# EAGLE design 3310 (EAGLE 9.1.3)
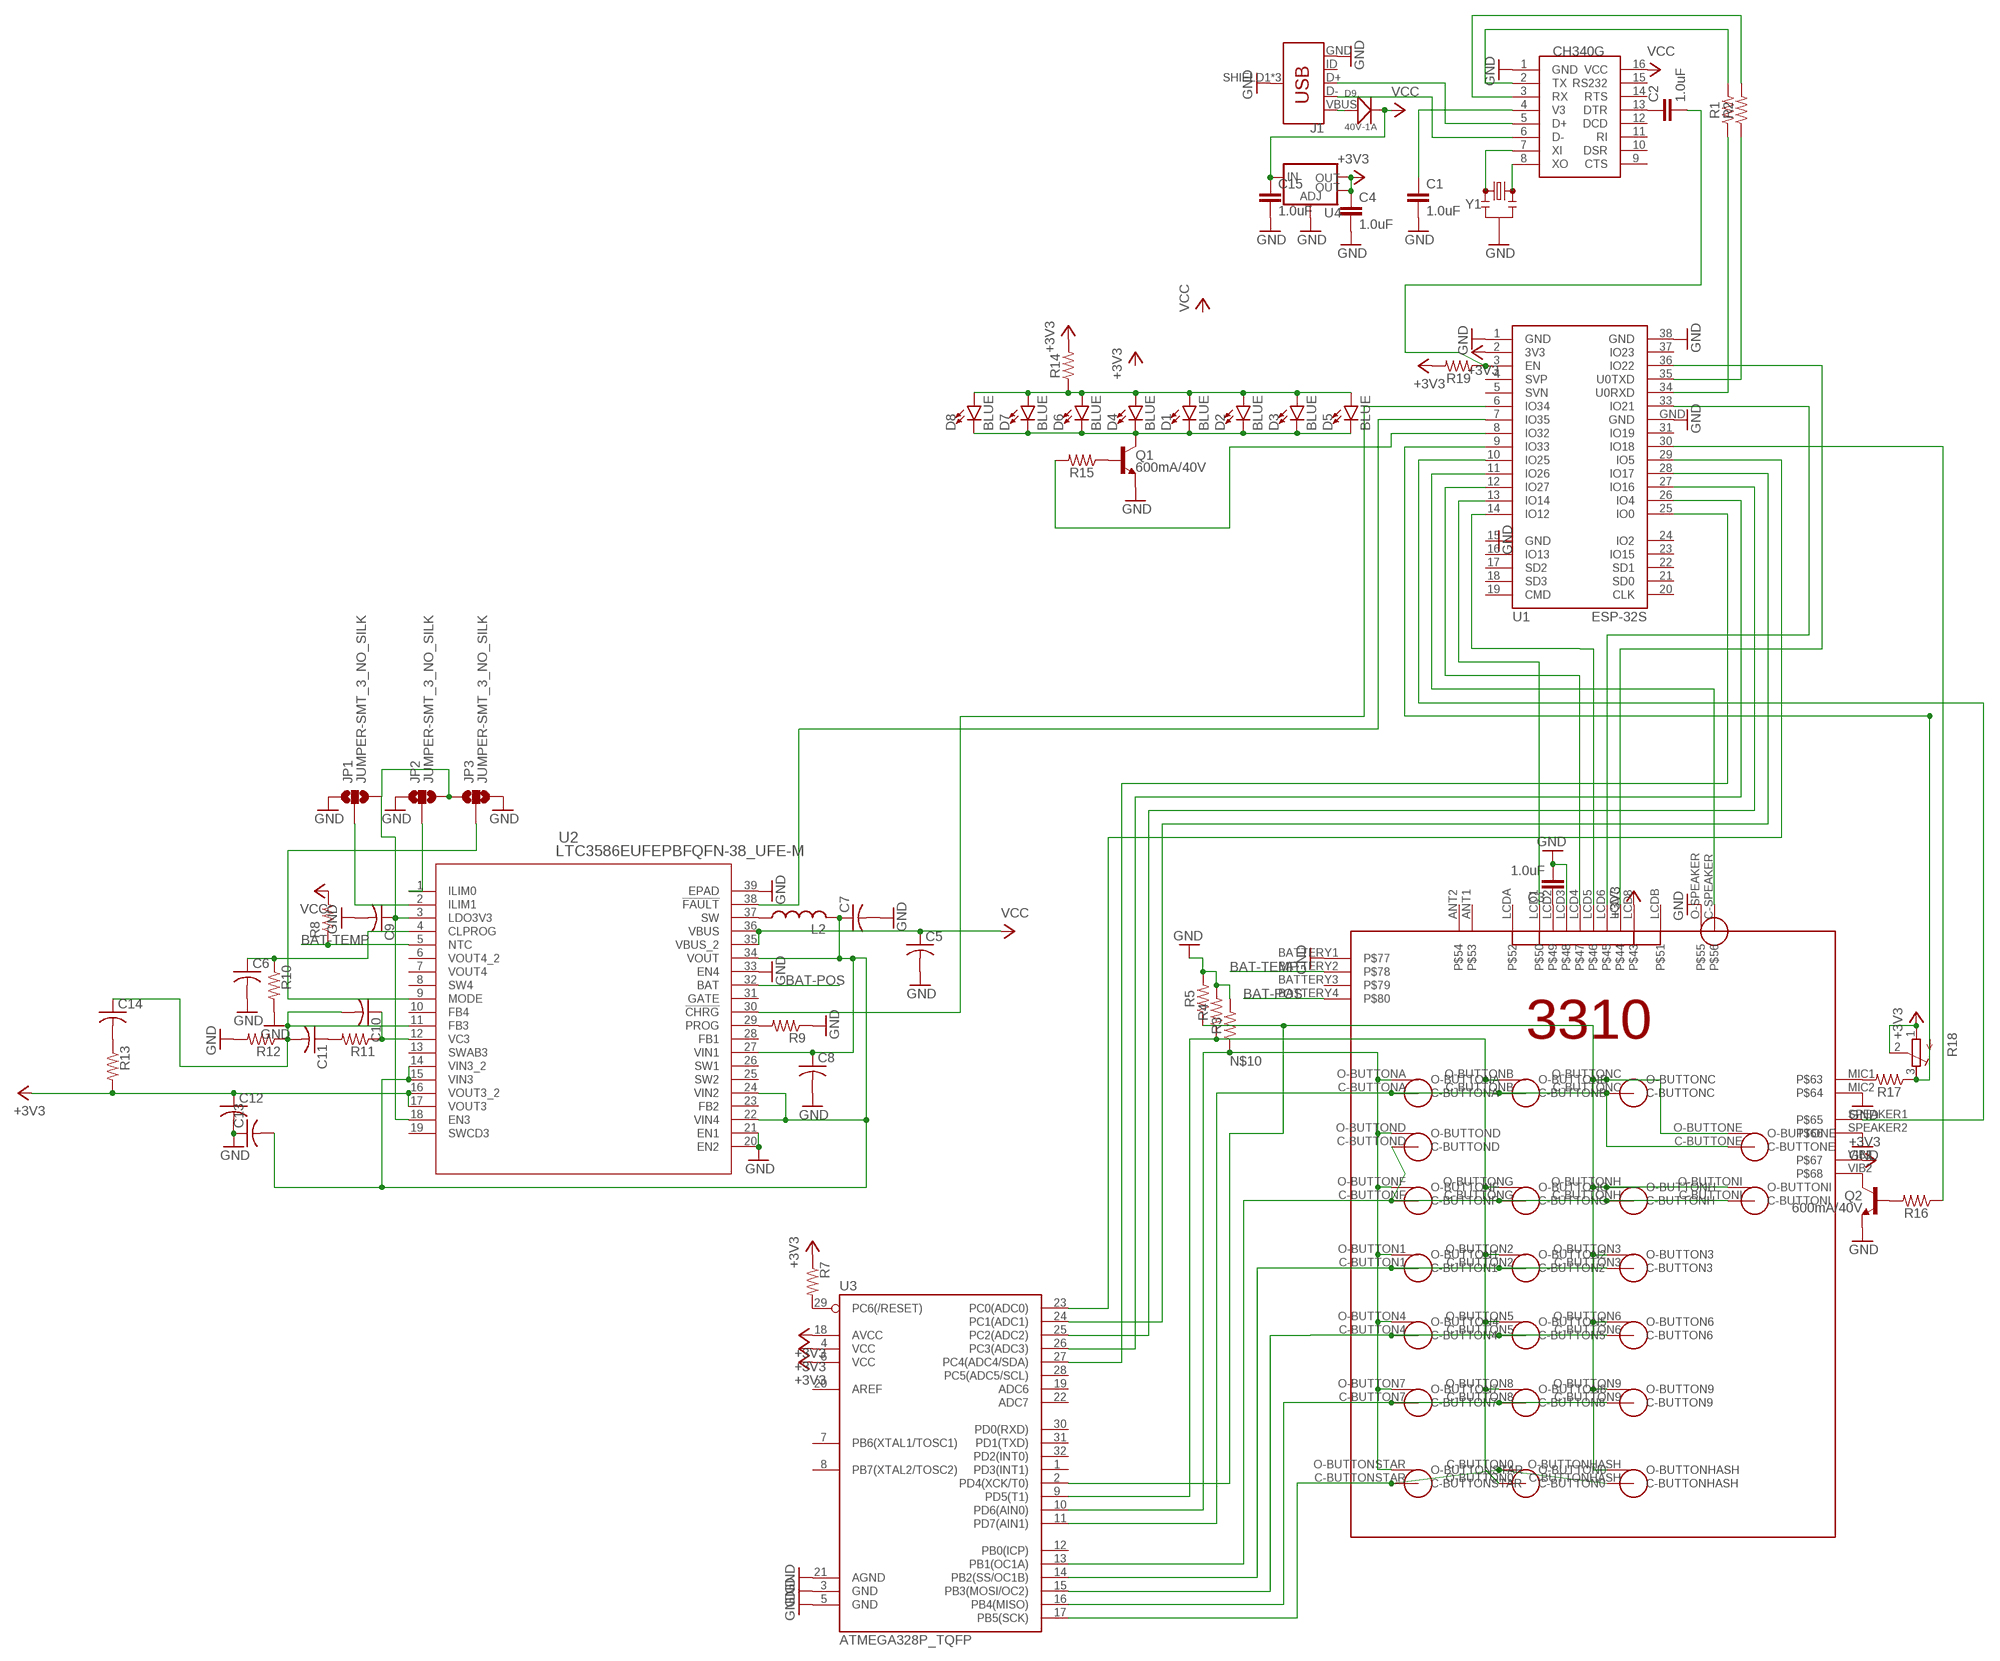
[diagram p0: schematic, sheet 1]

## Parts
C1  1.0uF  1.0UF-0805-25V-10%  [0805]
C2  1.0uF  1.0UF-0805-25V-10%  [0805]
C3  1.0uF  1.0UF-0805-25V-10%  [0805]
C4  1.0uF  1.0UF-0805-25V-10%  [0805]
C5  C-USC0805K  [C0805K]
C6  C-USC0805K  [C0805K]
C7  C-USC0805K  [C0805K]
C8  C-USC0805K  [C0805K]
C9  C-USC0805K  [C0805K]
C10  C-USC0805K  [C0805K]
C11  C-USC0805K  [C0805K]
C12  C-USC0805K  [C0805K]
C13  C-USC0805K  [C0805K]
C14  C-USC0805K  [C0805K]
C15  1.0uF  1.0UF-0805-25V-10%  [0805]
D1  BLUE  LED-BLUE1206  [LED-1206]
D2  BLUE  LED-BLUE1206  [LED-1206]
D3  BLUE  LED-BLUE1206  [LED-1206]
D4  BLUE  LED-BLUE1206  [LED-1206]
D5  BLUE  LED-BLUE1206  [LED-1206]
D6  BLUE  LED-BLUE1206  [LED-1206]
D7  BLUE  LED-BLUE1206  [LED-1206]
D8  BLUE  LED-BLUE1206  [LED-1206]
D9  40V-1A  SMD-DIODE-SCHOTTKY-40V-1A(DO-214AC)  [DO-214AC]
J1  USB_MICRO-BREDUCED_PASTE  [USB-B-MICRO-SMD_RED_PASTE]
JP1  JUMPER-SMT_3_NO_SILK  [SMT-JUMPER_3_NO_SILK]
JP2  JUMPER-SMT_3_NO_SILK  [SMT-JUMPER_3_NO_SILK]
JP3  JUMPER-SMT_3_NO_SILK  [SMT-JUMPER_3_NO_SILK]
L2  L-USL3216C  [L3216C]
Q1  600mA/40V  TRANS_NPN-MMBT2222AL  [SOT23-3]
Q2  600mA/40V  TRANS_NPN-MMBT2222AL  [SOT23-3]
R1  RESISTOR0805  [0805]
R2  RESISTOR0805  [0805]
R3  RESISTOR0805  [0805]
R4  RESISTOR0805  [0805]
R5  RESISTOR0805  [0805]
R7  R-US_R0805  [R0805]
R8  R-US_R0805  [R0805]
R9  R-US_R0805  [R0805]
R10  R-US_R0805  [R0805]
R11  R-US_R0805  [R0805]
R12  R-US_R0805  [R0805]
R13  R-US_R0805  [R0805]
R14  RESISTOR0805  [0805]
R15  RESISTOR0805  [0805]
R16  RESISTOR0805  [0805]
R17  RESISTOR0805  [0805]
R18  R-TRIMM3103  [RTRIM3103]
R19  RESISTOR0805  [0805]
U1  ESP-32S  [ESP-32S]
U2  LTC3586EUFEPBFQFN-38_UFE-M  [QFN-38_UFE-M]
U3  ATMEGA328P_TQFP  [TQFP32-08]
U4  V_REG_LM1117SOT223  [SOT223]
U$1  3310NOJACKANDSIM  [3310NOJACKANDSIM]
U$2  CH340G  [SOIC16]
Y1  RESONATORSMD-3.2X1.3  [RESONATOR-SMD-3.2X1.3]

## Nets
+3V3: C4.1 C12.1 R7.1 R13.2 R14.2 R18.1(A) R18.2(S) R19.2 U1.2(3V3) U2.16(VOUT3_2) U2.17(VOUT3) U3.4(VCC) U3.6(VCC) U3.18(AVCC) U4.2(OUT) U4.4(OUT) U$1.LCD8 U$1.VIB1
BAT-POS: U2.32(BAT) U$1.BATTERY4
BAT-TEMP: R8.1 U2.5(NTC) U$1.BATTERY2
GND: C1.2 C3.2 C4.2 C5.2 C6.2 C7.2 C8.2 C9.2 C12.2 C13.1 C15.2 J1.GND J1.SHIELD1(SHIELD) J1.SHIELD2(SHIELD) J1.SHIELD3(SHIELD) JP1.1 JP2.1 JP3.3 Q1.2(E) Q2.2(E) R3.2 R4.2 R5.2 R9.1 R10.2 R12.2 U1.1(GND) U1.15(GND) U1.38(GND) U1.GND U2.20(EN2) U2.21(EN1) U2.33(EN4) U2.39(EPAD) U3.3(GND) U3.5(GND) U3.21(AGND) U4.1(ADJ) U$1.BATTERY1 U$1.LCD3 U$1.MIC2 U$1.O-SPEAKER U$1.SPEAKER2 U$2.1(GND) Y1.2
N$1: J1.D- U$2.6(D-)
N$2: D1.A D2.A D3.A D4.A D5.A D6.A D7.A D8.A R14.1
N$3: U3.17(PB5(SCK)) U$1.C-BUTTON0(O-BUTTON0) U$1.C-BUTTONHASH U$1.C-BUTTONSTAR
N$4: U3.16(PB4(MISO)) U$1.C-BUTTON7 U$1.C-BUTTON8 U$1.C-BUTTON9
N$5: U3.15(PB3(MOSI/OC2)) U$1.C-BUTTON4 U$1.C-BUTTON5 U$1.C-BUTTON6
N$6: U3.14(PB2(SS/OC1B)) U$1.C-BUTTON1 U$1.C-BUTTON2 U$1.C-BUTTON3
N$7: U3.13(PB1(OC1A)) U$1.C-BUTTOND U$1.C-BUTTONF U$1.C-BUTTONG U$1.C-BUTTONH U$1.C-BUTTONI
N$8: R5.1 U3.2(PD4(XCK/T0)) U$1.O-BUTTON3 U$1.O-BUTTON6 U$1.O-BUTTON9 U$1.O-BUTTONC U$1.O-BUTTONE U$1.O-BUTTONH U$1.O-BUTTONHASH U$1.O-BUTTONI
N$9: U3.11(PD7(AIN1)) U$1.C-BUTTONA U$1.C-BUTTONB U$1.C-BUTTONC U$1.C-BUTTONE
N$10: R3.1 U3.10(PD6(AIN0)) U$1.O-BUTTON1 U$1.O-BUTTON4 U$1.O-BUTTON7 U$1.O-BUTTONA U$1.O-BUTTOND U$1.O-BUTTONF U$1.O-BUTTONSTAR
N$12: R4.1 U3.9(PD5(T1)) U$1.O-BUTTON0(C-BUTTON0) U$1.O-BUTTON2 U$1.O-BUTTON5 U$1.O-BUTTON8 U$1.O-BUTTONB U$1.O-BUTTONG
N$13: J1.D+ U$2.5(D+)
N$15: D9.1(+) J1.VBUS
N$16: U$2.8(XO) Y1.3
N$17: U$2.7(XI) Y1.1
N$18: C1.1 U$2.4(V3)
N$19: C2.1 U$2.13(DTR)
N$20: C2.2 R19.1 U1.3(EN)
N$21: R1.2 U$2.2(TX)
N$22: R2.2 U$2.3(RX)
N$23: R1.1 U1.34(U0RXD)
N$24: R2.1 U1.35(U0TXD)
N$25: U1.14(IO12) U$1.LCD5
N$26: C3.1 U$1.LCD2
N$27: U1.13(IO14) U$1.LCD1
N$28: U1.12(IO27) U$1.LCD4
N$29: U1.36(IO22) U$1.LCD7
N$30: U1.33(IO21) U$1.LCD6
N$31: R9.2 U2.29(PROG)
N$32: C6.1 R10.1 U2.4(CLPROG)
N$33: L2.1 U2.37(SW)
N$34: C14.2 R13.1
N$35: C9.1 JP1.3 JP2.3 JP3.1 U2.3(LDO3V3) U2.18(EN3)
N$36: U1.7(IO35) U2.38(!FAULT)
N$37: C10.1 R11.1 U2.12(VC3)
N$38: C11.1 R11.2
N$39: C10.2 C11.2 C14.1 R12.1 U2.11(FB3)
N$40: JP2.2 U2.1(ILIM0)
N$41: C7.1 C8.1 C13.2 L2.2 U2.14(VIN3_2) U2.15(VIN3) U2.22(VIN4) U2.24(VIN2) U2.27(VIN1) U2.34(VOUT)
N$42: JP1.2 U2.2(ILIM1)
N$43: U1.6(IO34) U2.30(!CHRG)
N$44: U1.29(IO5) U3.23(PC0(ADC0))
N$45: U1.28(IO17) U3.24(PC1(ADC1))
N$46: R7.2 U3.29(PC6(/RESET))
N$47: U1.27(IO16) U3.25(PC2(ADC2))
N$48: U1.26(IO4) U3.26(PC3(ADC3))
N$49: U1.25(IO0) U3.27(PC4(ADC4/SDA))
N$50: D1.C D2.C D3.C D4.C D5.C D6.C D7.C D8.C Q1.3(C)
N$51: Q1.1(B) R15.1
N$52: R15.2 U1.8(IO32)
N$53: Q2.3(C) U$1.VIB2
N$54: Q2.1(B) R16.2
N$55: R16.1 U1.30(IO18)
N$56: JP3.2 U2.9(MODE)
N$57: R17.2 U$1.MIC1
N$58: R17.1 R18.3(E) U1.9(IO33)
N$60: U1.11(IO26) U$1.C-SPEAKER
N$61: U1.10(IO25) U$1.SPEAKER1
VCC: C5.1 C15.1 D9.2(-) R8.2 U2.35(VBUS_2) U2.36(VBUS) U4.3(IN) U$2.16(VCC)
Unconnected: J1.ID U1.4(SVP) U1.5(SVN) U1.16(IO13) U1.17(SD2) U1.18(SD3) U1.19(CMD) U1.20(CLK) U1.21(SD0) U1.22(SD1) U1.23(IO15) U1.24(IO2) U1.31(IO19) U1.37(IO23) U2.6(VOUT4_2) U2.7(VOUT4) U2.8(SW4) U2.10(FB4) U2.13(SWAB3) U2.19(SWCD3) U2.23(FB2) U2.25(SW2) U2.26(SW1) U2.28(FB1) U2.31(GATE) U3.1(PD3(INT1)) U3.7(PB6(XTAL1/TOSC1)) U3.8(PB7(XTAL2/TOSC2)) U3.12(PB0(ICP)) U3.19(ADC6) U3.20(AREF) U3.22(ADC7) U3.28(PC5(ADC5/SCL)) U3.30(PD0(RXD)) U3.31(PD1(TXD)) U3.32(PD2(INT0)) U$1.ANT1 U$1.ANT2 U$1.BATTERY3 U$1.LCDA U$1.LCDB U$2.9(CTS) U$2.10(DSR) U$2.11(RI) U$2.12(DCD) U$2.14(RTS) U$2.15(RS232)

## Library data of the parts
C1-C4 C15 = SparkFun-Capacitors:1.0UF: 1µF ceramic capacitors A capacitor is a passive two-terminal electrical component used to store electrical energy temporarily in an electric field.; PROD_ID: CAP-08064
C5-C14 = rcl:C-US: CAPACITOR, American symbol; SPICEPREFIX: C
D1-D8 = SparkFun-LED:LED-BLUE: Blue SMD LED Used in manufacturing of various products at SparkFun Packages: 0603 - SMD 0603 package [Product Link] <http://www.digikey.com/product-detail/en/SMLE12BC7TT86/511-1589-2-ND/1641808> 1206 - SMD1206 package [Product Link] <http://www.digikey.com/product-detail/en/lite-on-inc/LTST-C150TBKT/160-1643-1-ND/573584> SparkFun Products: ESP8266 Thing-Dev Board <https://www.sparkfun.com/products/13711> RedBoard <https://www.sparkfun.com/products/12757>; PROD_ID: DIO-09911
D9 = Seeed-Diode:SMD-DIODE-SCHOTTKY-40V-1A(DO-214AC): 304020027; MPN: 1N5819
J1 = SparkFun-Connectors:USB_MICRO-B: USB Type Micro-B Connector Male/female and PTH/SMT variants SparkFun Products: SparkFun microB USB Breakout <https://www.sparkfun.com/products/12035> SparkFun USB microB Plug Breakout <https://www.sparkfun.com/products/10031> SparkFun ESP8266 Thing <https://www.sparkfun.com/products/13231>; PROD_ID: CONN-11752
JP1-JP3 = SparkFun-Jumpers:JUMPER-SMT_3_NO: Normally open jumper This jumper has three pads in close proximity to each other. Apply solder to close the connection(s).
L2 = rcl:L-US: INDUCTOR, American symbol; SPICEPREFIX: L
Q1 Q2 = SparkFun-DiscreteSemi:TRANS_NPN: NPN transistor Current controlled devices typically used to amplify current or used as a switch. BC547 - COM-08928 <http://www.sparkfun.com/products/8928> (TO-92 45V 100mA) (1.Collector 2.Base 3.Emitter) 2N3904 - COM-00521 <http://www.sparkfun.com/products/521> (TO-92 40V 200mA) (1.Emitter 2.Base 3.Collector) P2N2222A - COM-12852 <http://www.sparkfun.com/products/12852> (TO-92 40V 600mA) (1.Collector 2.Base 3.Emitter); PROD_ID: TRANS-08049
R1-R5 R14-R17 R19 = SparkFun-Resistors:RESISTOR: Generic Resistor Package
R7-R13 = rcl:R-US_: RESISTOR, American symbol; SPICEPREFIX: R
R18 = rcl:R-TRIMM: Trimm resistor; SPICEMODEL: X; SPICEPREFIXL: POT
U1 = esp32:ESP-32S: Ai-Thinker ESP-32S
U2 = LTC3586:LTC3586EUFEPBF; MANUFACTURER_PART_NUMBER: LTC3586EUFE#PBF; VENDOR: Linear Technology
U3 = SparkFun-IC-Microcontroller:ATMEGA328P_TQFP: Popular 328P in QFP Storefront component: ATmega328 - TQFP <https://www.sparkfun.com/products/13448> (COM-13448) Datasheet <http://www.sparkfun.com/datasheets/Components/SMD/ATMega328.pdf> SparkFun Products SparkFun RedBoard - Programmed with Arduino <https://www.sparkfun.com/products/12757> (DEV-12757) Arduino Pro Mini 328 - 5V/16MHz <https://www.sparkfun.com/products/11113> (DEV-11113) Arduino Pro Mini 328 - 3.3V/8MHz <https://www.sparkfun.com/products/11114> (DEV-11114) SparkFun OpenLog <https://www.sparkfun.com/products/13712> (DEV-13712) SparkFun MicroView - OLED Arduino Module <https://www.sparkfun.com/products/12923> (DEV-12923) SparkFun Digital Sandbox <https://www.sparkfun.com/products/12651> (DEV-12651) SparkFun PicoBoard <https://www.sparkfun.com/products/11888> (WIG-11888) Arduino Fio <https://www.sparkfun.com/products/10116> (DEV-10116) LilyPad Arduino 328 Main Board <https://www.sparkfun.com/products/13342> (DEV-13342) SparkFun RedStick <https://www.sparkfun.com/products/13741> (DEV-13741) LilyPad MP3 <https://www.sparkfun.com/products/11013> (DEV-11013) LilyPad Arduino SimpleSnap <https://www.sparkfun.com/products/10941> (DEV-10941) SparkFun Stepoko <https://www.sparkfun.com/products/13899> (ROB-13899) SparkFun Geiger Counter <https://www.sparkfun.com/products/11345> (SEN-11345) SparkFun EL Sequencer <https://www.sparkfun.com/products/12781> (COM-12781) Arduino Pro 328 - 5V/16MHz <https://www.sparkfun.com/products/10915> (DEV-10915) CryptoCape <https://www.sparkfun.com/products/12773> (DEV-12773) SparkFun IR Thermometer Evaluation Board - MLX90614 <https://www.sparkfun.com/products/10740> (SEN-10740) SparkFun RedBot Mainboard <https://www.sparkfun.com/products/12097> (ROB-12097) Arduino Pro 328 - 3.3V/8MHz <https://www.sparkfun.com/products/10914> (DEV-10914) SparkFun Block for Intel® Edison - Arduino <https://www.sparkfun.com/products/13036> (DEV-13036) SparkFun Simon Says - Surface Mount Soldering Kit <https://www.sparkfun.com/products/10935> (KIT-10935) SparkFun 7-Segment Serial Display - Red <https://www.sparkfun.com/products/11441> (COM-11441) SparkFun 7-Segment Serial Display - White <https://www.sparkfun.com/products/11629> (COM-11629) SparkFun 7-Segment Serial Display - Yellow <https://www.sparkfun.com/products/11443> (COM-11443) SparkFun 7-Segment Serial Display - Kelly Green <https://www.sparkfun.com/products/11440> (COM-11440) SparkFun 7-Segment Serial Display - Blue <https://www.sparkfun.com/products/11442> (COM-11442) SparkFun OpenSegment Serial Display - 20mm (Blue) <https://www.sparkfun.com/products/11647> (COM-11647) SparkFun OpenSegment Serial Display - 20mm (Green) <https://www.sparkfun.com/products/11646> (COM-11646) SparkFun OpenSegment Serial Display - 20mm (White) <https://www.sparkfun.com/products/11648> (COM-11648) SparkFun OpenSegment Serial Display - 20mm (Red) <https://www.sparkfun.com/products/11644> (COM-11644) SparkFun OpenSegment Serial Display - 20mm (Yellow) <https://www.sparkfun.com/products/11645> (COM-11645) SparkFun OpenSegment Shield <https://www.sparkfun.com/products/13190> (DEV-13190); PROD_ID: IC-09069
U4 = SparkFun-IC-Power:V_REG_LM1117: Voltage Regulator LM1117 Standard adjustable voltage regulator but in SMD form. Spark Fun Electronics SKU : COM-00595; PROD_ID: VREG-08170
U$1 = 3310:3310NOJACKANDSIM
U$2 = ch340g:CH340G
Y1 = SparkFun-Clocks:RESONATOR: Resonators (Generic) Ceramic resonators are clock-generating components, often used to control timing in microcontrollers. They usually have 3 pins: two pins for oscillation, and one pin for ground. Compared to crystals, resonators have worse tolerance, but are usually much cheaper. Plus, they have built-in load capacitors! These devices are used on boards like the Arduino Pro 8MHz <https://www.sparkfun.com/products/11114> and Arduino Pro 16MHz <https://www.sparkfun.com/products/11113>.

## Board
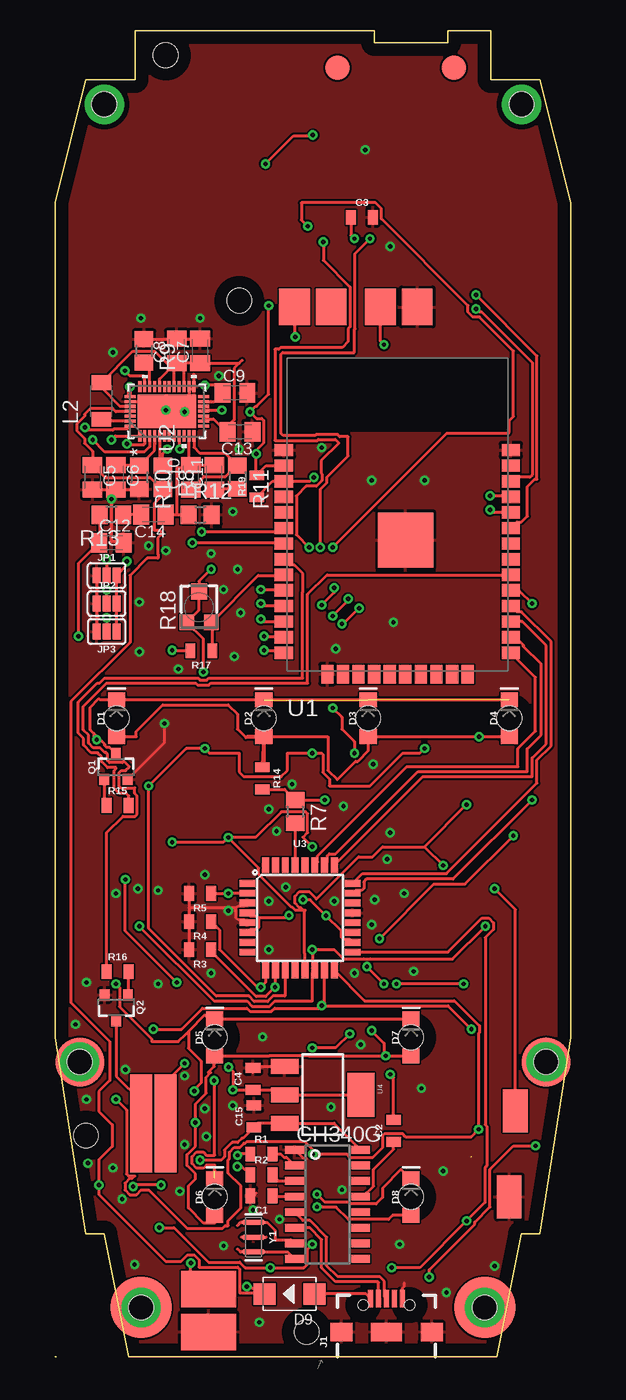
[diagram p1: board, top side]
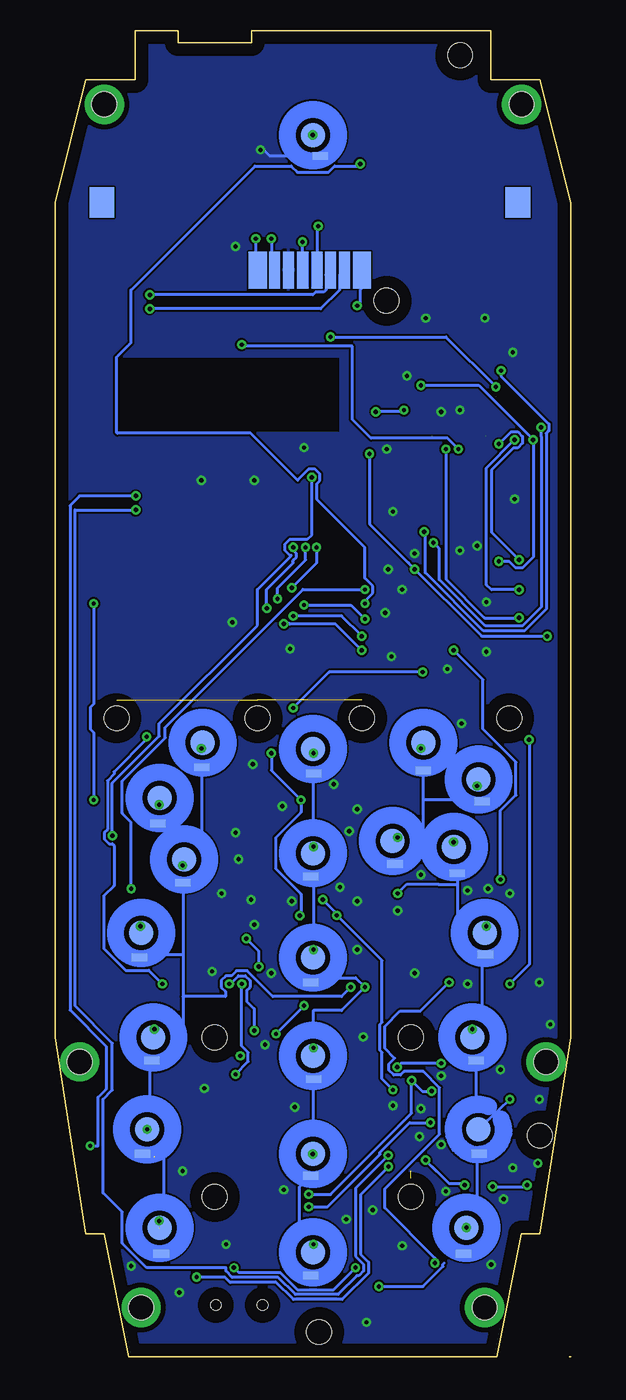
[diagram p2: board, bottom side, seen from below]

Size 42 x 108 mm. Coordinates in mm from the lower left corner, seen from the top.
Copper layers (1*16): Top 0.035mm / dielectric 1.5mm / Bottom 0.035mm
Design rules "default *": minimum track width 10mil, minimum drill 0.3mm, track to track 6mil, track to pad 6mil, pad to pad 6mil, via to via 6mil, smd to smd 6mil, copper to edge 40mil, drill to drill 8mil, minimum pad ring 10mil, minimum via ring 8mil, stop-mask expansion 4mil, vias tented up to drill 0mil, thermal gap 10mil

### Footprints (pad centres in the part's own frame; a part is rotated, then mirrored left to right if it is on the bottom)
0805 = smd 0.8 x 1.2: 1 -0.9,0; 2 0.9,0
C0805K = smd 1.3 x 1.6: 1 -1,0; 2 1,0
LED-1206 = smd 1.2 x 1.4: A -1.5,0; C 1.5,0
DO-214AC = smd 1.8 x 1.77: 1 -2.042,0; 2 2.042,0
USB-B-MICRO-SMD_RED_PASTE = smd 1.45 x 0.4: D+ 2.725,0; D- 2.725,0.65; GND 2.725,-1.3; ID 2.725,-0.65; VBUS 2.725,1.3 | smd 1.5 x 1.8: SHIELD1 0,3.685; SHIELD2 0,-3.685 | smd 1.5 x 2.5: SHIELD3 0,0 | hole 0.85: 2.2,1.9; 2.2,-1.9
SMT-JUMPER_3_NO_SILK = smd 0.635 x 1.27: 1 -0.813,0; 2 0,0; 3 0.813,0
L3216C = smd 1.2 x 1.6: 1 -1.5,0; 2 1.5,0
SOT23-3 = smd 0.8 x 0.9: 1 -0.95,-1; 2 0.95,-1; 3 0,1.1
R0805 = smd 1.3 x 1.5: 1 -0.95,0; 2 0.95,0
RTRIM3103 = smd 1.2 x 1.25: 1 -1,-1.225; 3 1,-1.225 | smd 1.3 x 1.3: 2 0,1.3
ESP-32S = smd 1.5 x 1: 1 -9.25,7; 2 -9.25,5.73; 3 -9.25,4.46; 4 -9.25,3.19; 5 -9.25,1.92; 6 -9.25,0.65; 7 -9.25,-0.62; 8 -9.25,-1.89; 9 -9.25,-3.16; 10 -9.25,-4.43; 11 -9.25,-5.7; 12 -9.25,-6.97; 13 -9.25,-8.24; 14 -9.25,-9.51; 25 9.25,-9.51; 26 9.25,-8.24; 27 9.25,-6.97; 28 9.25,-5.7; 29 9.25,-4.43; 30 9.25,-3.16; 31 9.25,-1.89; 32 9.25,-0.62; 33 9.25,0.65; 34 9.25,1.92; 35 9.25,3.19; 36 9.25,4.46; 37 9.25,5.73; 38 9.25,7 | smd 1 x 1.5: 15 -5.7,-11.25; 16 -4.43,-11.25; 17 -3.16,-11.25; 18 -1.89,-11.25; 19 -0.62,-11.25; 20 0.65,-11.25; 21 1.92,-11.25; 22 3.19,-11.25; 23 4.46,-11.25; 24 5.73,-11.25 | smd 4.5 x 4.5: GND 0.68,-0.33
QFN-38_UFE-M = smd 0.906 x 0.25: 1 -2.003,2.2; 2 -2.003,1.8; 3 -2.003,1.4; 4 -2.003,1; 5 -2.003,0.6; 6 -2.003,0.2; 7 -2.003,-0.2; 8 -2.003,-0.6; 9 -2.003,-1; 10 -2.003,-1.4; 11 -2.003,-1.8; 12 -2.003,-2.2; 20 2.003,-2.2; 21 2.003,-1.8; 22 2.003,-1.4; 23 2.003,-1; 24 2.003,-0.6; 25 2.003,-0.2; 26 2.003,0.2; 27 2.003,0.6; 28 2.003,1; 29 2.003,1.4; 30 2.003,1.8; 31 2.003,2.2 | smd 0.25 x 0.906: 13 -1.2,-3.003; 14 -0.8,-3.003; 15 -0.4,-3.003; 16 0,-3.003; 17 0.4,-3.003; 18 0.8,-3.003; 19 1.2,-3.003; 32 1.2,3.003; 33 0.8,3.003; 34 0.4,3.003; 35 0,3.003; 36 -0.4,3.003; 37 -0.8,3.003; 38 -1.2,3.003 | smd 2.75 x 4.75: 39 0,0
TQFP32-08 = smd 1.27 x 0.559: 1 -4.293,2.8; 2 -4.293,2; 3 -4.293,1.2; 4 -4.293,0.4; 5 -4.293,-0.4; 6 -4.293,-1.2; 7 -4.293,-2; 8 -4.293,-2.8; 17 4.293,-2.8; 18 4.293,-2; 19 4.293,-1.2; 20 4.293,-0.4; 21 4.293,0.4; 22 4.293,1.2; 23 4.293,2; 24 4.293,2.8 | smd 0.559 x 1.27: 9 -2.8,-4.293; 10 -2,-4.293; 11 -1.2,-4.293; 12 -0.4,-4.293; 13 0.4,-4.293; 14 1.2,-4.293; 15 2,-4.293; 16 2.8,-4.293; 25 2.8,4.293; 26 2,4.293; 27 1.2,4.293; 28 0.4,4.293; 29 -0.4,4.293; 30 -1.2,4.293; 31 -2,4.293; 32 -2.8,4.293
SOT223 = smd 1.219 x 2.235: 1 -2.311,-3.099; 2 0,-3.099; 3 2.311,-3.099 | smd 3.6 x 2.2: 4 0,3.099
3310NOJACKANDSIM = smd 2 x 2 bottom: ANT1 9.5,105; ANT2 19,105 | smd 2.5 x 3 bottom: BATTERY1 12.5,85.5; BATTERY2 15.5,85.5; BATTERY3 19.5,85.5; BATTERY4 22.5,85.5 | smd 2 x 2: C-BUTTON0 21,8.5; C-BUTTON1 7,34.5; C-BUTTON2 21,32.5; C-BUTTON3 35,34.5; C-BUTTON4 8,26; C-BUTTON5 21,24.5; C-BUTTON6 34,26; C-BUTTON7 7.5,18.5; C-BUTTON8 21,16.5; C-BUTTON9 34.5,18.5; C-BUTTONA 12,50; C-BUTTONB 21,49.5; C-BUTTONC 30,50; C-BUTTOND 8.5,45.5; C-BUTTONE 34.5,47; C-BUTTONF 10.5,40.5; C-BUTTONG 21,41; C-BUTTONH 27.5,42; C-BUTTONHASH 33.5,10.5; C-BUTTONI 32.5,41.5; C-BUTTONSTAR 8.5,10.5; C-SPEAKER 21,99.5 | smd 1.5 x 3: LCD1 16.5,88.5; LCD8 25,88.5 | smd 0.9 x 3: LCD2 17.875,88.5; LCD3 19.025,88.5; LCD4 20.175,88.5; LCD5 21.325,88.5; LCD6 22.45,88.5; LCD7 23.58,88.5 | smd 2 x 2.5: LCDA 3.8,94; LCDB 37.7,94 | smd 4.5 x 3 bottom: MIC1 29.5,5.5; MIC2 29.5,2 | smd 1.27 x 0.635: O-BUTTON0 20.828,6.604; O-BUTTON1 6.858,32.512; O-BUTTON2 20.828,30.48; O-BUTTON3 35.052,32.766; O-BUTTON4 7.874,24.13; O-BUTTON5 21.082,22.606; O-BUTTON6 34.29,24.13; O-BUTTON7 7.112,16.51; O-BUTTON8 20.828,14.732; O-BUTTON9 34.544,16.51; O-BUTTONA 11.938,48.006; O-BUTTONB 21.082,47.498; O-BUTTONC 29.972,47.752; O-BUTTOND 8.382,43.434; O-BUTTONE 34.798,45.212; O-BUTTONF 10.414,38.608; O-BUTTONG 20.828,39.116; O-BUTTONH 27.686,40.132; O-BUTTONHASH 33.274,8.382; O-BUTTONI 32.766,39.37; O-BUTTONSTAR 8.636,8.382; O-SPEAKER 21.59,97.79 | smd 4 x 4 bottom: P$18 40,24; P$45 2,24; P$46 40,24; P$69 2,24 | drill 2 pad 3.2: P$37 7,4; P$38 35,4; P$39 40,24; P$40 2,24; P$41 38,102; P$42 4,102 | smd 5 x 5 bottom: P$43 7,4; P$44 35,4; P$70 7,4; P$71 35,4 | smd 2 x 3.5 bottom: SPEAKER1 4.5,20; SPEAKER2 5,13 | smd 1.8 x 8 bottom: VIB1 33,19; VIB2 35,19 | hole 2: 27,86; 4,102; 38,102; 5,52; 16.5,52; 25,52; 37,52; 13,26; 29,26; 29,13; 13,13; 7,4; 35,4; 40,24; 2,24; 21.5,2; 39.5,18; 33,106
SOIC16 = smd 0.635 x 1.524: 1 -4.445,-2.695; 2 -3.175,-2.695; 3 -1.905,-2.695; 4 -0.635,-2.695; 5 0.635,-2.695; 6 1.905,-2.695; 7 3.175,-2.695; 8 4.445,-2.695; 9 4.445,2.695; 10 3.175,2.695; 11 1.905,2.695; 12 0.635,2.695; 13 -0.635,2.695; 14 -1.905,2.695; 15 -3.175,2.695; 16 -4.445,2.695
RESONATOR-SMD-3.2X1.3 = smd 0.45 x 1.905: 1 -1.2,0; 2 0,0; 3 1.2,0

### Placement (x,y rotation side)
C1  16.8,13.1 180 top
C2  27.58,18.39 90 top
C3  25,92.8 0 top
C4  16.12,22.62 90 top
C5  3.05,71.63 270 top
C6  4.95,71.63 270 top
C7  11.81,81.92 90 top
C8  9.91,81.92 90 top
C9  14.65,78.49 0 top
C10  11.05,71.63 90 top
C11  12.95,71.63 90 top
C12  4.57,66.29 0 top
C13  15.06,75.33 180 top
C14  8,68.58 180 top
C15  16.19,19.57 90 top
D1  5,52 90 top
D2  17,52 90 top
D3  25.5,52 90 top
D4  37,52 90 top
D5  13,26 90 top
D6  13,13 90 top
D7  29,26 90 top
D8  29,13 90 top
D9  19.1,5.1 180 top
J1  27,2 90 top
JP1  4.19,63.63 0 top
JP2  4.19,61.34 0 top
JP3  4.19,59.05 180 top
L2  3.77,77.84 90 top
Q1  4.95,48.01 0 top
Q2  4.97,28.44 180 top
R1  16.8,16.5 0 top
R2  16.8,14.8 0 top
R3  11.81,33.15 180 top
R4  11.81,35.43 180 top
R5  11.81,37.72 180 top
R7  19.55,44.4 270 top
R8  8.76,71.63 270 top
R9  7.24,81.92 270 top
R10  6.86,71.63 270 top
R11  14.86,71.63 270 top
R12  11.81,68.58 0 top
R13  4.57,68.58 180 top
R14  16.89,47.1 270 top
R15  5.09,44.88 0 top
R16  5.09,31.35 0 top
R17  11.91,57.5 180 top
R18  11.73,61.03 0 top
R19  16.42,70.89 90 top
U1  27.88,66.84 0 top
U2  9.1,77 90 top
U3  19.95,35.74 0 top
U4  21.8,21.32 270 top
U$1  42,0 0 bottom
U$2  22.2,12.4 270 top
Y1  16.17,9.72 270 top

### Tracks (layer width: path | path; a pad name or v marks a point on that pad's centre or on a via)
+3V3  (via drill 0.35)
  Top 0.254: U2.17 12.1,77.22 U2.16 12.19,77.09 v13.59,77.09 | U1.2 17.2,72.57 R19.2 16.38,71.82 v16.38,73.53 16.38,73.81 16.99,74.42 16.99,76.25 16.83,76.41 16.43,76.41 v15.88,76.96 16.33,77.42 16.42,77.42 17.39,78.39 v17.39,85.6 | U4.4 U4.2 18.31,21.72 C4.1 v14.48,21.72 14.48,23.24 v14.13,23.58 | 11.73,62.23 11.73,60.81 R18.1 12.06,58.47 v12.06,55.75 | 11.73,62.23 R18.2 | U$1.VIB1 9,22.34 v10.54,23.88 | R13.2 3.62,66.34 C12.1 1.91,64.63 v1.91,58.67 | v12.7,64.14 11.73,63.16 11.73,62.23 | 16.57,35.74 16.4,35.9 15.89,35.9 U3.4 | 16.57,35.74 16.57,34.95 16.4,34.78 15.89,34.78 U3.6 | v20.19,37.21 20.77,37.21 v22.07,35.91 23.32,34.66 23.32,34.15 23.49,33.98 24,33.98 U3.18 | 16.57,35.74 18.85,35.74 v19.05,35.94 | v21.97,45.34 v21.96,45.34 R7.1 18.69,46.2 R14.2 | 22.61,52.7 v22.61,52.83 23.36,52.08 23.36,51.11 24.38,50.09 v24.38,49.15
  Bottom 0.254: v10.54,23.88 13.84,23.88 v14.13,23.58 | v16.38,73.53 16.38,67.82 13.21,64.64 | 13.21,64.64 v12.7,64.14 | 13.21,64.64 7.24,58.67 v1.91,58.67 | v13.59,77.09 13.72,76.96 v15.88,76.96 | v17.39,85.6 17.14,85.85 17.14,86.89 17.02,87.01 17.02,88.48 U$1.LCD8 | v20.19,37.21 19.05,36.07 v19.05,35.94 15.37,32.26 15.37,27.24 15.55,27.06 15.55,24.94 15.37,24.76 15.37,22.61 v14.48,21.72 | v22.07,35.91 21.97,36.01 21.97,37.67 24.04,39.74 24.04,42.26 21.97,44.33 v21.97,45.34 24.38,47.75 v24.38,49.15 | v12.06,55.75 19.68,55.75 v22.61,52.83
BAT-POS  (via drill 0.35)  (1 unrouted)
  Top 0.254: U$1.BATTERY4 19.5,83.12 v19.56,83.06 | v6.1,78.99 U2.32 | U2.32 5.97,78.33 5.97,78.87 6.1,78.74 U2.32
  Bottom 0.254: v19.56,83.06 10.16,83.06 v6.1,78.99
BAT-TEMP  (via drill 0.35)
  Top 0.254: U2.5 8.5,72.84 R8.1 8.76,73.53 v9.14,73.91 | v26.8,82.42 26.5,82.72 U$1.BATTERY2
  Bottom 0.254: v9.14,73.91 10.03,74.8 16.26,74.8 17.78,76.33 17.78,82.3 26.67,82.3 v26.8,82.42
GND  (via drill 0.35)
  Top 0.254: 16.15,13.1 C1.2 16.15,13.1 | 16.15,13.1 16.38,13.34 16.15,13.1 | 16.12,23.11 C4.2 16.23,23.63 U4.1 | JP1.1 JP2.1 JP3.3 | U2.33 7.42,77.8 7.49,77.72 8.38,77.72 U2.39 9.95,77.85 10.9,77.85 | U2.21 10.9,77.85 | 10.9,77.85 10.9,77.19 10.79,77.09 11.05,77.34 11.05,77.6 10.92,77.72 10.92,78.62 U2.20 11.3,79.98 11.3,79.99 | R9.1 11.76,82.86 C7.2 | C5.2 6.81,70.63 R10.2 | C6.2 4.57,70.25 4.57,66.42 5.45,66.42 C12.2 | R5.2 10.91,36.58 | 10.91,36.58 R4.2 R3.2 | 14.74,36.54 14.74,35.75 14.9,35.59 15.41,35.59 U3.5 | 14.74,36.54 14.9,36.7 15.41,36.7 U3.3 | 14.74,36.54 10.95,36.54 10.91,36.58 | Q1.2 8.89,49.99 v8.89,51.56 | U$2.1 20.18,16.17 20.4,16.17 20.44,16.13 | J1.GND 28.3,5.57 28.45,5.71 28.45,5.97
  Bottom 0.254: U$1.O-SPEAKER 24.51,97.79 25.27,98.55
  other vias: 27.3,90.42 25.27,98.3 14.1,36.32 17.4,33.15 22.73,37.08 26.04,37.21 25.78,35.18 24.38,31.24 29.21,31.37 8.38,30.35 2.54,30.48 4.95,37.72 12.7,31.24 8.38,37.97 6.73,38.1 12.19,39.24 17.4,37.08 25.78,71.37 30.1,71.37 21.72,74.04 4.7,15.37 2.54,20.95 5.71,23.37 6.48,7.49 16.64,2.79 13.72,9.02 10.16,13.46 5.46,12.83 2.67,15.75 28.07,9.14 31.88,5.21 35.81,7.37 31.62,15.11 9.02,65.66 14.48,68.83 12.7,65.41 14.86,64.14 13.72,62.48 6.86,61.47 6.86,57.4 10.03,56.01 14.61,57.02 15.11,60.58 4.57,69.85 7.62,66.04 22.86,57.66 27.56,59.82 14.48,20.45 23.37,13.59 13.34,79.88 11.81,84.58 6.99,84.58 4.7,81.79 10.54,76.96 9.02,77.09 18.8,38.23 18.03,42.8 17.4,44.58 23.5,44.83 27.05,40.51 27.3,42.67 25.91,48.26 19.3,46.61 28.45,37.72 10.54,17.27 10.54,22.86 12.19,20.19 12.32,17.91 16.89,26.04 24.89,25.4 29.84,21.84 22.48,20.32 16.13,11.94 18.29,11.18 1.65,27.05 14.99,73.91
  pour Top: 6.1,107.82 6.86,107.06 6.86,104.01 2.29,104.01 1.91,103.63 -0.38,94.11 -0.38,19.68 1.12,10.42 4.19,9.91 5.71,0.38 35.81,-1.52 38.48,10.67 39.62,9.91 42.67,24.77 42.67,93.73 39.62,103.25 35.81,104.39 36.2,107.44 32.77,108.2 30.86,106.68 26.29,106.68 25.91,108.2
  pour Bottom: 6.1,107.82 6.86,107.06 6.86,104.01 2.29,104.01 1.91,103.63 0,95.69 0,18.1 1.25,10.4 4.19,9.91 5.71,0.38 35.81,-1.52 38.48,10.67 39.62,9.91 42.67,24.77 42.67,93.73 39.62,103.25 35.81,104.39 36.2,107.44 32.77,108.2 30.86,106.68 26.29,106.68 25.91,108.2
  pour Top: 6.1,107.82 6.86,107.06 6.86,104.01 2.29,104.01 1.91,103.63 -0.76,92.52 -0.76,22.03 1.12,10.42 4.19,9.91 5.71,0.38 35.81,-1.52 38.48,10.67 39.62,9.91 42.67,24.77 42.67,93.73 39.62,103.25 35.81,104.39 36.2,107.44 32.77,108.2 30.86,106.68 26.29,106.68 25.91,108.2
N$1
  Top 0.254: J1.D- 26.35,6.04 26.29,6.1 22.86,6.1 21.72,7.24 21.72,9.53 20.75,10.49 U$2.6
N$2  (via drill 0.35)
  Top 0.254: 6.22,50.5 D1.A 6.22,50.5 | D2.A 22.23,50.5 22.23,47.75 22.99,46.99 24.49,48.49 24.66,48.49 25.5,49.34 D3.A 25.91,50.5 34.42,50.5 | 34.42,50.5 v34.54,50.5 | v34.54,50.5 34.67,50.5 | 34.67,50.5 D4.A | 12.95,23.86 13,23.86 | D8.A 27.5,11.5 27.17,11.17 23.88,11.17 22.89,12.17 21.8,12.17 21.78,12.19 v21.34,12.19 | 12.95,23.86 12.95,23.62 12.47,23.14 12.68,23.14 12.3,22.75 12.3,21.44 11.43,20.57 v11.43,19.05 11.43,17.13 10.75,16.44 10.75,15.56 11.43,14.88 11.43,14.46 10.86,13.89 10.86,12.11 12.11,10.86 13,10.86 D6.A | D7.A v26.92,24.5 26.8,24.5 | 26.8,24.5 21.24,24.5 21.23,24.49 20.68,24.49 20.65,24.52 17.47,24.52 17.45,24.5 D5.A 13,23.9 12.95,23.86 | D2.A 17,48.12 R14.1 | D2.A 15.62,50.5 | 6.22,50.5 6.6,50.5 6.6,50.93 8.76,53.09 14.1,53.09 14.86,52.33 14.86,51.11 15.54,50.42 D2.A | R14.1 16.89,48.13 | 16.89,48.13 D2.A | R14.1 16.89,48.13 | 34.42,50.5 v34.54,50.5 | v34.54,50.5 34.67,50.5 | v33.27,30.35 v27.81,30.35 | v25.78,26.54 26.8,25.53 26.8,24.5
  Bottom 0.254: v21.34,12.19 19.81,12.19 15.52,16.49 15.52,16.66 13.12,19.05 v11.43,19.05 | v34.54,50.5 34.54,50.29 37.21,47.62 37.21,47.44 37.74,46.9 37.74,42.94 38,42.69 38,42.15 37.61,41.76 37.36,41.76 37.21,41.62 37.21,38.35 38.04,37.52 38.04,33.24 36.26,31.46 34.38,31.46 v33.27,30.35 | v25.78,26.54 25.78,28.32 26.39,28.93 26.39,29.83 26.14,30.08 26.14,30.62 26.52,31.01 27.07,31.01 27.73,30.35 v27.81,30.35
N$3  (via drill 0.35)  (1 unrouted)
  Top 0.254: v20.95,9.14 20.55,8.73 20.55,7.52 20.26,7.24 v17.53,7.24 15.48,7.24 15.03,7.69 12.49,7.69 9.67,10.5 U$1.C-BUTTONHASH | v27.43,7.24 29.72,7.24 v33.53,11.05 35.03,12.55 35.03,15.41 35.16,15.54 35.16,18.77 35.05,18.88 35.05,34.12 35.71,34.78 35.71,35.32 35.32,35.71 34.78,35.71 32.01,32.94 U3.17
  Bottom 0.254: 33.53,10.5 v33.53,11.05 | U$1.C-BUTTON0 21,9.14 v20.95,9.14 | v27.43,7.24 27.05,6.86 23.66,6.86 22.26,5.46 19.31,5.46 v17.53,7.24
  other vias: 8.5,10.5
N$4  (via drill 0.35)
  Top 0.254: U$1.C-BUTTON8 20.95,16.5 20.95,16.38 | v4.95,20.95 5.82,20.09 5.82,14.88 5.98,14.72 6.48,14.72 6.26,14.5 6.08,14.5 5.69,14.12 5.69,13.57 6.08,13.19 6.62,13.19 7,13.56 7.63,13.56 10.75,10.45 13.65,10.45 13.86,10.67 14.1,10.67 14.1,11.07 15.14,12.11 15.14,13.89 14.1,14.93 14.1,16 14.2,16.11 14.2,16.66 14.59,17.04 15.04,17.04 15.38,17.38 15.47,17.38 15.62,17.53 20.3,17.53 21,16.82 U$1.C-BUTTON8 | U$1.C-BUTTON8 23.77,16.5 24.02,16.25 25.91,16.25 26.7,17.04 26.7,18 26.86,18.16 28.3,18.16 28.55,17.91 33.91,17.91 U$1.C-BUTTON7 34.5,26.33 34.57,26.4 34.57,26.94 32.53,28.98 25.22,28.98 U3.16
  Bottom 0.254: 6.75,19.25 U$1.C-BUTTON9 v4.95,20.95
  other vias: 21,16.5 34.5,18.5
N$5  (via drill 0.35)
  Top 0.254: v8,26.67 10.29,26.67 12,28.38 15.62,28.38 15.88,28.12 17.65,28.12 17.91,28.38 21.52,28.38 v21.72,28.57 | v24,26.29 22.86,25.15 v20.95,25.15 | v21.72,28.57 21.95,28.8 U3.15 | v21.72,28.57 32,28.57 v33.91,26.67
  Bottom 0.254: U$1.C-BUTTON4 34,26.58 v33.91,26.67 | U$1.C-BUTTON5 20.95,24.55 v20.95,25.15 | U$1.C-BUTTON6 v8,26.67 | v21.72,28.57 v24,26.29
N$6  (via drill 0.35)
  Top 0.254: v35.05,35.05 32.38,32.38 25.7,32.38 25.67,32.41 25.13,32.41 25.11,32.38 23.49,32.38 22.73,33.15 v20.95,33.15 20.95,31.64 U3.14 20.95,31.26 20.95,28.96 17.91,28.96 17.48,28.52 16.05,28.52 15.62,28.96 12.95,28.96 v6.86,35.05
  Bottom 0.254: U$1.C-BUTTON3 7,34.91 v6.86,35.05 | U$1.C-BUTTON2 21,33.1 v20.95,33.15 | U$1.C-BUTTON1 35.05,34.55 v35.05,35.05
N$7  (via drill 0.35)
  Top 0.254: v9.53,41.91 13.72,41.91 v14.1,42.29 | 30.1,41.53 v31.62,40.01 | v33.53,44.96 30.1,41.53 | U3.13 20.35,32.83 20.3,32.88 20.3,36.28 | v14.1,42.29 16.59,39.8 16.59,39.29 19.27,36.6 19.32,36.6 19.55,36.38 20.39,36.38 20.3,36.28 | 30.1,41.53 26.68,41.53 25.86,40.71 24.73,40.71 21.29,37.27 20.69,37.87 19.92,37.87 19.54,37.48 19.54,36.94 19.92,36.55 20.02,36.55 20.3,36.28 | v20.95,41.53 20.19,42.29 20.19,42.3 20.58,42.68 20.58,44.21 20.41,44.37 18.43,44.37 16.34,42.29 v14.1,42.29
  Bottom 0.254: U$1.C-BUTTOND 33.53,45.47 v33.53,44.96 | U$1.C-BUTTONF 31.5,40.13 v31.62,40.01 | U$1.C-BUTTONG 20.95,41.05 v20.95,41.53 | U$1.C-BUTTONH 14.21,42.29 v14.1,42.29 | U$1.C-BUTTONI 9.5,41.88 v9.53,41.91
N$8  (via drill 0.35)
  Top 0.254: 14.12,37.74 v14.1,37.72 | U3.2 14.12,37.74 | R5.1 12.74,37.74 14.12,37.74
  Bottom 0.254: U$1.O-BUTTONC 12.03,45.34 | 12.03,45.34 12.03,41.75 11.81,41.53 | 11.81,41.53 13.21,40.13 U$1.O-BUTTONH | 11.81,41.53 11.05,40.77 11.05,40.39 10.03,39.37 U$1.O-BUTTONI 9.23,38.46 | U$1.O-BUTTONE 7.33,45.34 12.03,45.34 | 9.23,38.46 9.23,34 8,32.77 U$1.O-BUTTON3 7.24,32.48 7.24,27.81 6.1,26.67 6.1,25.15 6.86,24.38 7.46,24.38 U$1.O-BUTTON6 7.71,20.66 | U$1.O-BUTTON9 6.73,16.51 5.71,17.53 | 7.71,20.66 7.24,20.19 | U$1.O-BUTTON9 7.62,16.35 7.62,12.19 6.48,11.05 6.48,9.91 8,8.38 U$1.O-BUTTONHASH | U$1.O-BUTTON9 8.51,16.51 9.53,17.53 9.53,19.43 8.94,19.43 7.71,20.66 | v14.1,37.72 13.34,38.48 10.78,38.48 10.76,38.46 9.23,38.46
N$9  (via drill 0.35)
  Top 0.254: v30.1,49.53 29.72,49.15 28.32,49.15 25.65,46.48 22.35,46.48 22.35,47.05 21.82,47.58 21.82,49.05 21.72,49.15 v20.95,49.15 18.92,49.15 18.92,47.75 18.41,47.24 15.37,47.24 14.99,47.62 14.99,49.15 12.57,49.15 v12.19,49.53 10.67,49.53 v7.62,46.48 7.62,34.87 13.12,29.36 15.78,29.36 16.21,28.93 17.31,28.93 17.75,29.36 18.69,29.36 18.75,29.41 U3.11
  Bottom 0.254: U$1.C-BUTTONC 12,49.72 v12.19,49.53 | U$1.C-BUTTONE 7.5,46.6 v7.62,46.48 | U$1.C-BUTTONB 21,49.19 v20.95,49.15 | U$1.C-BUTTONA 30,49.63 v30.1,49.53
N$10  (via drill 0.35)  (1 unrouted)
  Top 0.254: U3.10 17.91,31.41 v17.91,30.1 17.14,29.34 16.38,29.34 12.71,33.01 R3.1
  Bottom 0.254: U$1.O-BUTTON4 34.29,23.97 | 34.29,23.97 34.29,20.57 35.05,20.57 36.58,19.05 36.58,17.91 35.18,16.51 U$1.O-BUTTON7 34.13,16.51 33.91,16.29 | U$1.O-BUTTONA 30.06,42.29 | 30.06,42.29 30.06,41.95 30.1,41.91 29.34,41.15 29.34,39.62 30.35,38.61 U$1.O-BUTTONF 31.59,32.77 | U$1.O-BUTTOND 33.15,43.43 32,42.29 30.06,42.29 | 31.59,32.77 31.59,29.34 | 31.59,29.34 31.59,25.95 33.56,23.97 34.29,23.97 | U$1.O-BUTTON1 34.89,32.77 31.59,32.77 | U$1.O-BUTTONSTAR 34.29,8.38 35.43,9.53 35.43,10.67 33.15,12.95 33.15,16.6 33.91,16.6 33.91,16.22 33.91,16.76 | v17.91,30.1 18.67,29.34 24.28,29.34 26.36,31.42 27.24,31.42 27.64,31.01 28.09,31.01 28.47,30.62 28.47,30.08 28.13,29.74 28.13,29.34 31.59,29.34
N$12  (via drill 0.35)
  Top 0.254: U3.9 17.15,30.48 v16.76,30.1 16.44,30.1 13.39,33.15 13.39,34.75 R4.1
  Bottom 0.254: 22.23,6.6 22.35,6.73 | 22.35,6.73 23.24,7.62 22.86,8 22.86,9.91 22.1,10.67 22.1,13.81 U$1.O-BUTTON8 22.35,14.73 22.86,15.24 22.86,17.14 21.34,18.67 20.95,18.67 20.95,22.57 U$1.O-BUTTON5 21.84,22.61 22.86,23.62 22.86,25.53 22.48,25.53 21.34,26.67 20.95,26.67 20.95,28.19 18.67,28.19 v16.76,30.1 | U$1.O-BUTTON2 20.95,30.26 | U$1.O-BUTTON2 22.86,32.17 22.86,33.15 20.95,35.05 20.95,38.9 U$1.O-BUTTONG 21.3,39.24 22.48,39.24 22.86,39.62 22.86,41.53 21.34,43.05 20.95,43.05 20.95,47.46 U$1.O-BUTTONB | v16.76,30.1 17.91,28.96 | U$1.O-BUTTON2 20.79,30.86 17.53,30.86 v16.76,30.1 | U$1.O-BUTTON0 21.3,6.73 22.35,6.73
N$13
  Top 0.254: J1.D+ 26.83,4.9 26.83,6.13 26.46,6.5 23.03,6.5 22.12,7.41 22.12,9.73 20.76,11.09 20.18,11.09 U$2.5
N$15
  Top 0.254: J1.VBUS 25.32,5.1 D9.1
N$16
  Top 0.254: U$2.8 18.94,8.52 Y1.3 15.1,8.52 14.86,8.76
N$17
  Top 0.254: U$2.7 19.2,9.53 17.91,9.53 17.91,10.29 17.27,10.92 Y1.1 15.11,10.92 14.86,10.67
N$18
  Top 0.254: C1.1 17.77,13.04 U$2.4
N$19
  Top 0.254: U$2.13 25.1,13.04 25.94,13.87 25.94,15.24 27.58,16.89 C2.1
N$20  (via drill 0.35)
  Top 0.254: R19.1 17.73,71.3 U1.3 20.75,71.3 21.02,71.56 | C2.2 27.58,22.71 v27.3,22.99 | v26.8,30.35 v25.4,31.75 | v26.42,34.04 30.86,38.48 33.4,38.48 v37.34,42.42 | v21.08,71.63 21.02,71.56 | 21.02,71.56 20.95,71.5 21.08,71.5
  Bottom 0.254: v27.3,22.99 26.27,24.03 26.27,24.77 26.8,25.3 v26.8,30.35 | v25.4,31.75 25.4,33.02 v26.42,34.04 | v37.34,42.42 37.34,46.74 33.53,50.55 33.53,51.56 25.53,59.56 25.53,62.48 22.76,65.25 22.88,65.25 23.26,65.64 23.26,66.19 22.88,66.57 21.44,66.57 21.08,66.93 v21.08,71.63
N$21
  Top 0.254: U$2.2 18.83,16.25 18.63,16.25 18.38,16.5 R1.2
N$22
  Top 0.254: R2.2 18.2,14.3 U$2.3
N$23  (via drill 0.35)
  Top 0.254: U1.34 35.64,68.76 v35.43,68.96 | R1.1 14.98,16.5 v14.86,16.38
  Bottom 0.254: v35.43,68.96 40.39,68.96 40.39,28.57 37.34,25.53 37.34,21.72 38.1,20.95 38.1,13.34 36.54,11.78 36.54,9.24 34.54,7.24 28.09,7.24 28.09,6.97 27.57,6.45 23.83,6.45 22.43,5.05 18.95,5.05 17.42,6.58 17.25,6.58 16.87,6.97 16.87,7.51 17.53,8.17 17.53,13.72 v14.86,16.38
N$24  (via drill 0.35)
  Top 0.254: U1.35 37.05,70.1 v35.43,70.1 | R2.1 15.23,15.47 v14.84,15.47 | v30.48,6.48 30.48,7.07 34.19,10.78 34.19,10.95 35.43,12.19 35.43,15.24 37.35,17.16 v39.14,17.16
  Bottom 0.254: v35.43,70.1 40.01,70.1 40.79,69.32 40.79,28.22 37.86,25.28 37.86,21.77 38.51,21.12 38.51,17.14 | 38.51,17.14 38.51,17.27 | v14.84,15.47 17.12,13.19 17.12,8.34 16.46,7.68 16.46,6.8 18.61,4.65 22.6,4.65 24,6.04 27.74,6.04 28.18,6.48 v30.48,6.48 | v39.14,17.16 38.52,17.16 38.51,17.14
N$25  (via drill 0.35)
  Top 0.254: v17.02,57.53 18.43,57.53 U1.14 | v23.37,59.69 23.5,59.69 v24.77,60.96 | v22.61,65.91 31.9,75.21 36.93,75.21 37.01,75.28 37.01,76.25 37.34,76.58 37.34,81.92 34.57,84.69 34.02,84.69 33.63,85.07 33.63,85.62 26.58,92.67 26.58,93.52 26.11,93.98 20.07,93.98 20.07,92.58 v20.57,92.08
  Bottom 0.254: v23.37,59.69 22.9,59.69 22.88,59.67 19.15,59.67 v17.02,57.53 | v24.77,60.96 24.77,62.48 22.61,64.64 22.61,64.83 22.35,65.09 22.35,65.42 22.61,65.68 v22.61,65.91 | v20.57,92.08 20.68,91.97 U$1.LCD5
N$26  (via drill 0.35)
  Top 0.254: C3.1 24.1,91.34 v24.38,91.06
  Bottom 0.254: v24.38,91.06 24.38,88.76 U$1.LCD2
N$27  (via drill 0.35)
  Top 0.254: U1.13 17.09,58.6 v17.02,58.67 | v22.61,60.33 23.88,61.59 v23.88,61.72 | v25.65,91.06 24.44,89.84 24.44,83.72 24.38,83.66 24.38,81.79 18.54,81.79 18.41,81.66 18.41,75.18 18.57,75.02 21.2,75.02 21.28,75.11 23.01,75.11 23.18,74.93 23.88,74.93 23.88,73.36 22.15,71.63 22.15,71.19 21.61,70.65 v21.61,65.91
  Bottom 0.254: v17.02,58.67 18.67,60.33 v22.61,60.33 | v23.88,61.72 23.88,62.61 21.59,64.9 21.59,65.89 v21.61,65.91 | v25.65,91.06 25.65,88.65 U$1.LCD1
N$28  (via drill 0.35)
  Top 0.254: v21.84,90.81 21.84,89.3 24.03,87.12 24.03,83.88 23.88,83.73 23.88,82.68 23.39,82.19 18.37,82.19 18.22,82.04 17.91,82.04 17.91,74.62 21.36,74.62 21.45,74.7 22.84,74.7 23.11,74.42 21.67,72.98 21.67,71.97 21.74,71.9 21.74,71.36 21.28,70.89 20.45,70.89 19.66,70.1 19.66,66.95 v20.7,65.91 | v22.73,62.61 22.73,62.23 v21.72,61.21 | v16.76,60.07 16.97,59.87 U1.12
  Bottom 0.254: U$1.LCD4 21.84,88.52 v21.84,90.81 | v20.7,65.91 20.7,64.64 v22.73,62.61 | v21.72,61.21 17.91,61.21 v16.76,60.07
N$29  (via drill 0.35)
  Top 0.254: U1.36 37.46,71.63 38.67,71.63 38.86,71.82 38.86,80.97 34.73,85.09 34.54,85.09 v34.29,85.34
  Bottom 0.254: U$1.LCD7 18.82,88.1 18.82,86.88 20.36,85.34 v34.29,85.34
N$30  (via drill 0.35)
  Top 0.254: v34.29,86.49 39.27,81.51 39.27,71.46 39.08,71.46 38.48,70.87 38.48,68.46 38,67.98 37.62,67.98 U1.33
  Bottom 0.254: U$1.LCD6 19.95,88.1 19.95,86.88 20.11,86.72 20.77,86.72 21.01,86.49 v34.29,86.49
N$31
  Top 0.254: U2.29 7.7,80.5 R9.2
N$32
  Top 0.254: C6.1 6.81,72.63 R10.1 8.09,73.81 8.09,74.3 | 8.09,74.3 8.09,74.42 | U2.4 8.1,74.3 8.09,74.3
N$33
  Top 0.254: U2.37 3.81,76.2 3.67,76.34 | 3.43,76.58 3.67,76.34 | 3.67,76.34 L2.1
N$34
  Top 0.254: C14.2 R13.1
N$35  (via drill 0.35)
  Top 0.254: U2.18 12.68,77.8 12.96,77.8 13.49,78.33 C9.1 13.03,79.12 v12.19,79.12 | JP3.1 JP2.3 JP1.3 5.84,64.47 v5.84,64.77 | U2.3 7.7,74.12 7.26,73.68 4.04,73.68 v3.05,74.68
  Bottom 0.254: v5.84,64.77 4.99,64.77 4.46,64.24 3.92,64.24 3.05,65.11 v3.05,74.68 7.49,79.12 v12.19,79.12
N$36  (via drill 0.35)
  Top 0.254: U2.38 5.86,75.56 4.79,75.56 4.69,75.46 2.65,75.46 v2.41,75.69 | v11.18,66.29 18.55,66.29 U1.7
  Bottom 0.254: v2.41,75.69 2.41,74.97 2.39,74.95 2.39,61.05 3.92,59.52 6.93,59.52 10.69,63.28 10.69,65.81 v11.18,66.29
N$37  (1 unrouted)
  Top 0.254: C10.1 12.12,71.7 13.87,71.7 14.75,72.58 R11.1 13.88,73.56 11.81,73.56 11.31,74.06 U2.12
N$38
  Top 0.254: R11.2 13.01,70.68 C11.1
N$39
  Top 0.254: C10.2 C11.2 | U2.11 10.9,72.78 C10.2 | C10.2 10.81,72.39 9.91,72.39 9.91,68.58 | 9.91,68.58 R12.1 | C14.1 9.91,68.58
N$40  (via drill 0.35)  (1 unrouted)
  Top 0.254: JP2.2 v4.19,62.46 | v4.57,74.68 4.89,75 U2.1
  Bottom 0.254: v4.19,62.46 6.45,62.46 6.86,62.87 6.86,72.39 v4.57,74.68
N$41
  Top 0.254: U2.15 U2.14 12.23,76.33 12.83,76.33 12.88,76.39 13.94,75.33 C13.2 14.03,75.37 14.03,75.75 14.58,76.31 14.58,80.5 15.24,81.15 15,80.92 C7.1 C8.1 | U2.34 5.28,77.4 3.77,78.91 L2.2 6.33,81.89 8.11,81.89 9.08,80.92 C8.1 | U2.24 9.7,80.71 C8.1 | U2.27 8.5,79.64 9.78,80.92 C8.1 | U2.22 10.5,80.32 C8.1
N$42  (via drill 0.35)
  Top 0.254: U2.2 7.3,74.36 7.21,74.26 5.92,74.26 v5.84,74.34 | v4.19,64.9 JP1.2
  Bottom 0.254: v5.84,74.34 4.84,75.33 4.3,75.33 3.91,74.95 3.91,74.4 4.3,74.02 4.66,74.02 6.45,72.22 6.45,67.16 v4.19,64.9
N$43  (via drill 0.35)
  Top 0.254: U2.30 7.3,79.82 7.24,79.88 6.1,79.88 v5.67,80.31 | v11.94,67.18 18.33,67.18 U1.6
  Bottom 0.254: v5.67,80.31 5.67,79.88 1.75,75.96 1.75,75.42 1.98,75.19 1.98,60.88 3.75,59.11 7.1,59.11 11.83,63.84 11.83,67.08 v11.94,67.18
N$44  (via drill 0.35)
  Top 0.254: U1.29 37.8,62.41 v38.86,61.34 | U3.23 24.48,37.98 24.99,37.98 25.15,38.15 25.15,38.66 25.38,38.89 32.41,38.89 v38.86,45.34
  Bottom 0.254: v38.86,61.34 38.86,53.17 39.14,52.89 39.14,51.11 38.86,50.83 v38.86,45.34
N$45
  Top 0.254: U3.24 25.04,39.35 31.89,39.35 39.27,46.72 39.27,48.6 40.41,49.74 40.41,58.23 38,60.65 37.62,60.65 U1.28
N$46
  Top 0.254: R7.2 U3.29
N$47
  Top 0.254: U3.25 29.95,47.24 38.86,47.24 38.86,48.77 40.01,49.91 40.01,57.91 38.05,59.87 U1.27
N$48
  Top 0.254: U3.26 22.19,40.28 22.19,40.79 22.35,40.95 22.86,40.95 29.56,47.65 38.46,47.65 38.46,49.51 39.6,50.65 39.6,56.41 38.16,57.85 38.16,57.94 37.51,58.6 U1.26
N$49
  Top 0.254: U3.27 21.39,40.28 21.39,40.79 28.66,48.06 37.72,48.06 37.72,49.52 39.14,50.95 39.14,55.32 U1.25
N$50  (via drill 0.35)  (3 unrouted)
  Top 0.254: D7.C D5.C 12.51,27.5 12.19,27.81 10.86,26.48 10.86,26.29 | D4.C D1.C 3.65,53.5 3.56,53.59 2.86,52.89 2.86,51.06 3.15,50.77 | Q1.3 4.44,49.62 4.18,49.62 4.02,49.78 4.02,49.89 3.15,50.77 | v12.95,22.48 13,22.43 13,16.41 12.34,16.41 12.08,16.66 11.54,16.66 11.15,16.27 11.15,15.73 11.54,15.34 12.08,15.34 12.34,15.6 13,15.6 13,15.14 | 10.86,26.29 10.86,25.11 11.89,24.08 11.89,22.28 11.33,21.72 v11.33,21.62 | 10.86,26.29 10.67,26.29 | 10.67,26.29 | D8.C 28.93,14.5 28.19,15.24 26.67,13.72 26.67,12.95 26.15,12.44 24.02,12.44 23.88,12.57 21.97,12.57 v21.34,13.21 | 3.15,50.77 3.15,50.47 v3.38,50.24 | v4.95,30.35 5.25,30.06 5.25,28.5 7.87,25.87 7.87,25.65 10.03,25.65 10.67,26.29
  Bottom 0.254: v11.33,21.62 12.09,21.62 v12.95,22.48 12.95,19.81 19.56,13.21 v21.34,13.21 | v3.38,50.24 3.38,31.93 v4.95,30.35
N$51
  Top 0.254: Q1.1 4,45.07 R15.1
N$52
  Top 0.254: U1.8 19.12,64.46 19.5,64.46 20.19,63.76 20.19,62.3 20.17,62.27 20.17,55.27 12.51,55.27 12.34,55.09 11.79,55.09 11.62,55.27 4.02,55.27 3.62,54.86 3.43,54.86 1.88,53.31 1.88,50.78 2.31,50.34 2.31,49.8 2.94,49.17 3.48,49.17 3.79,48.87 3.79,48.45 4.27,47.97 4.96,47.97 4.96,47.88 4.82,47.74 4.82,46.27 5.22,45.87 5.79,45.87 5.99,45.67 R15.2
N$53
  Top 0.254: Q2.3 4.97,22.84 7,20.81 U$1.VIB2
N$54
  Top 0.254: Q2.1 5.99,29.51 R16.2
N$55
  Top 0.254: R16.1 4.19,42.67 5.52,44 6.51,44 6.67,44.17 6.67,45.68 6.48,45.87 6.48,46.34 6.42,46.28 5.39,46.28 5.22,46.44 5.22,47.57 5.39,47.73 5.75,47.73 6.06,48.04 5.6,48.51 5.47,48.38 4.44,48.38 4.27,48.54 4.27,49.07 4.13,49.21 4.02,49.21 3.65,49.58 3.1,49.58 2.72,49.97 2.72,50.62 2.29,51.05 2.29,52.96 4.19,54.86 11.45,54.86 11.62,54.69 12.51,54.69 12.68,54.86 20.57,54.86 20.57,62.1 22.15,63.68 U1.30
N$56  (via drill 0.35)
  Top 0.254: U2.9 10.1,73.97 v10.16,73.91 | v4.19,60.17 JP3.2
  Bottom 0.254: v10.16,73.91 10.16,63.32 7.02,60.17 v4.19,60.17
N$57  (via drill 0.35)
  Top 0.254: 12.95,5.71 12.74,5.5 U$1.MIC1 11.05,6.95 v11.05,7.62 | v9.91,30.48 5.71,34.67 v5.71,38.86 | v9.53,57.53 9.56,57.5 R17.2
  Bottom 0.254: v11.05,7.62 11.05,8.02 15.14,12.11 15.14,13.64 10.67,18.12 10.67,21.89 12,23.22 13.57,23.22 13.86,22.93 14.41,22.93 14.79,23.31 14.79,23.86 14.34,24.31 15.14,25.11 15.14,26.89 13.89,28.14 12.24,28.14 v9.91,30.48 | v5.71,38.86 5.71,44.48 4.46,45.74 4.46,48.43 6.34,50.31 7.14,51.11 7.14,55.15 v9.53,57.53
N$58
  Top 0.254: R17.1 12.81,59.72 R18.3 16.55,63.63 18.58,63.63 U1.9
N$60  (via drill 0.35)
  Top 0.254: U$1.C-SPEAKER 21,99.49 20.95,99.44 19.43,99.44 v17.14,97.16 | U1.11 16.97,61.14 v16.76,61.34
  Bottom 0.254: v16.76,61.34 16.76,61.55 16.11,62.21 16.11,62.76 16.76,63.41 16.76,65.91 20.68,69.83 20.68,71.1 20.42,71.36 20.42,71.9 20.81,72.29 21.35,72.29 22.25,71.39 26.06,75.21 36.93,75.21 37.01,75.28 37.01,81.39 35.81,82.58 35.81,86.87 25.72,96.97 22.77,96.97 22.26,96.46 19.74,96.46 19.23,96.97 16.95,96.97 v17.14,97.16
  other vias: 21,99.5
N$61  (via drill 0.35)
  Top 0.254: U$1.SPEAKER1 37.5,36.41 v35.81,38.1 | v16.76,62.48 18.55,62.48 U1.10
  Bottom 0.254: v35.81,38.1 35.81,43.51 36.54,44.24 36.54,46.9 33.04,50.4 33.04,51.26 21.82,62.48 v16.76,62.48
VCC  (via drill 0.35)
  Top 0.254: U$2.16 22.73,19.01 U4.3 16.53,19.01 C15.1 15.3,17.79 15.22,17.79 14.88,17.45 14.42,17.45 13.79,16.82 13.79,16.28 13.52,16 v11.81,16 | D9.2 16.88,5.18 | 16.88,5.18 v15.62,5.71 | U2.36 U2.35 6.06,76.96 4.94,76.96 4.69,77.22 2.85,77.22 2.39,76.75 2.39,76.6 1.75,75.96 1.75,75.42 2.39,74.78 2.39,74.4 3.05,73.75 C5.1 4.07,71.61 7.72,71.61 8.65,70.68 R8.2 8.76,70.19 8.07,69.5 8.07,67.31 8.51,67.31 8.76,67.06 8.36,66.65 8.36,65.39 8.38,65.36 8.38,65.02 7.49,65.02 6.1,63.63 6.1,58.17 1.27,53.34 1.27,28.83 4.45,25.65 4.45,22.48 3.56,21.59 3.56,19.98 4.64,18.89 4.64,17.11 3.56,16.02 v3.56,13.97 3.56,13.21 9.02,7.75 10.25,7.75 10.78,8.28 11.32,8.28 11.71,7.89 11.71,7.28 14.87,7.28 15.03,7.12 15.03,5.18 16.88,5.18 | v8.64,13.97 6.48,13.97 v6.35,13.84
  Bottom 0.254: 10.29,7.62 10.39,7.52 10.39,7.35 12.02,5.71 v15.62,5.71 | 10.86,15.05 v11.81,16 9.91,14.1 8.76,14.1 v8.64,13.97 | v6.35,13.84 3.68,13.84 v3.56,13.97